# Altium schematic sheet Template_PS_2Layer_SCH.SchDoc: Complete Schematic
size B; Date: Not shown in title block; ApprovedBy: Not shown in title block; CheckedBy: Not shown in title block; Author: Not shown in title block; CompanyName: Not shown in title block; DrawnBy: Not shown in title block; Engineer: Not shown in title block; Organization: Not shown in title block; Address1: Not shown in title block; Address2: Not shown in title block; Address3: Not shown in title block; Address4: Not shown in title block; DocumentNumber: 1; Revision: Use project parameter SCH_Rev; SheetNumber: 1; SheetTotal: 1; PageSetup: Record=PageOptions|CenterHorizontal=True|CenterVertical=True|PrintScale=0.72|XCorrection=1.00|YCorrection=1.00|PrintKind=0|BorderSize=5000000|LeftOffset=0|BottomOffset=0|Orientation=2|PaperLength=1000|PaperWidth=1000|Scale=100|PaperSource=15|PrintQuality=600|MediaType=1|DitherType=10|PaperKind=Letter|PrintScaleMode=1; CurrentTime: Not shown in title block; CurrentDate: Not shown in title block; Time: Not shown in title block; DocumentFullPathAndName: Not shown in title block; DocumentName: Not shown in title block; ModifiedDate: Not shown in title block; ImagePath: Not shown in title block
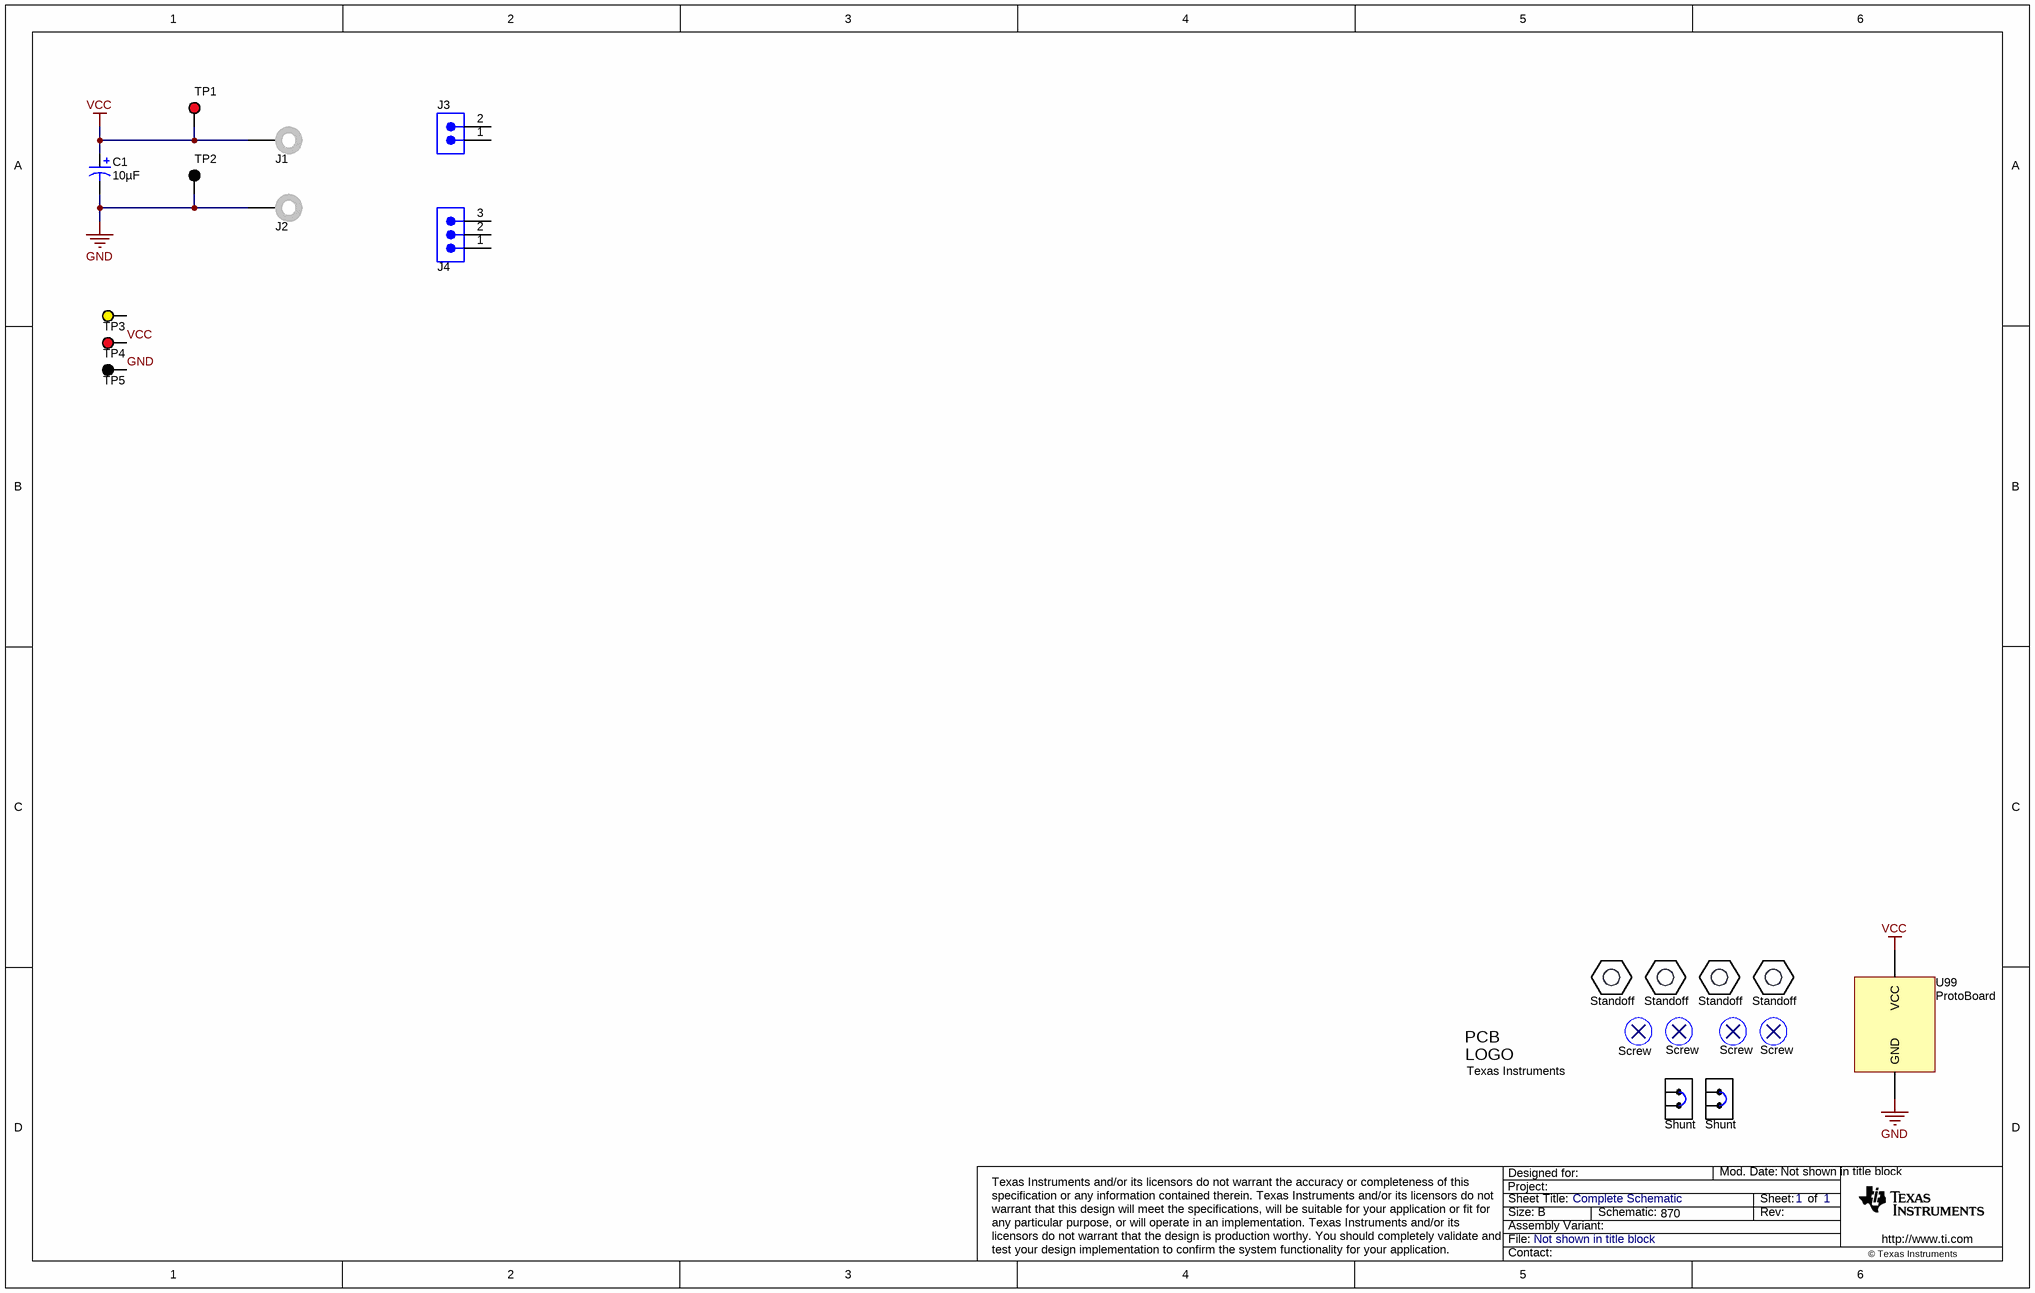
[diagram p0: Template_PS_2Layer_SCH.SchDoc]

## Parts
C1  ValueDisplayed: 10µF  [3528-21]  (hidden comment: TPSB106M020R1000)
J1  Banana Jack, Solder  [JACK NON-INSULATED .218"]  (value not drawn)
J2  Banana Jack, Solder  [JACK NON-INSULATED .218"]  (value not drawn)
J3  961102-6404-AR  [Header 100mil, 1x2]  (value not drawn)
J4  961103-6404-AR  [CONN HEADER VERT SGL 3POS GOLD]  (value not drawn)
J80  Shunt  (mechanical)
J81  Shunt  (mechanical)
Logo1  Texas Instruments  [TI_Symbol_Overlay_Small]  (no BOM)
TP1  5005  [Keystone5005]  (value not drawn)
TP2  5006  [Keystone5006]  (value not drawn)
TP3  5009  [Keystone5009]  (value not drawn)
TP4  5005  [Keystone5005]  (value not drawn)
TP5  5006  [Keystone5006]  (value not drawn)
U90  Standoff  [STANDOFF HEX 4-40THR ALUM 1"L]
U91  Standoff  [STANDOFF HEX 4-40THR ALUM 1"L]
U92  Standoff  [STANDOFF HEX 4-40THR ALUM 1"L]
U93  Standoff  [STANDOFF HEX 4-40THR ALUM 1"L]
U94  Screw  (mechanical)
U95  Screw  (mechanical)
U96  Screw  (mechanical)
U97  Screw  (mechanical)
U99  ProtoBoard  [ProtoArea]

## Nets
GND: C1.2(-) J2.1 TP2.1 TP5.1 U99.0(GND)
VCC: C1.1(+) J1.1 TP1.1 TP4.1 U99.17(VCC)

Not connected (* = marked no-connect by the designer): J3 1 2; J4 1 2 3; TP3 1

## Notes on the sheet
- Project:
- Designed for:
- Mod. Date:
- Sheet Title:
- Size:
- File:
- Assembly Variant:
- B
- Schematic:
- 870
- Rev:
- Sheet:
- of
- http://www.ti.com
- Texas Instruments and/or its licensors do not warrant the accuracy or completeness of this specification or any information contained therein. Texas Instruments and/or its licensors do not warrant that this design will meet the specifications, will be suitable for your application or fit for any particular purpose, or will operate in an implementation. Texas Instruments and/or its licensors do not warrant that the design is production worthy. You should completely validate and test your design implementation to confirm the system functionality for your application.
- Contact:
- © Texas Instruments
- (in symbol TI_Logo) PCB; LOGO

## Library data of the parts
C1 = TPSB106M020R1000: CAP, TANT, 10uF, 20V, +/-20%, 1 ohm, 3528-21 SMD; Manufacturer: AVX; Polarized: Y; CompType: Capacitor; U/M: EA; Cap_F: 0.00001; Tolerance_%: 20; Value1: 1 ohm; ESR_Ohm: 1; IRMS_A: 0.262; TaMin_C: -55; TaMax_C: 125; Cap_Case: B; SymbolVersion: 2008-07-09; Value: 10uF; PartNumber: TPSB106M020R1000; PackageReference: 3528-21; RoHS: Y; VDC_V: 20; Value2: 20V; MountType: SMT; Technology: TA; Series: TPS; Published: 2008-06-19; Publisher: Texas Instruments; LatestRevisionDate: 2012-08-28; LatestRevisionNote: Changed Publisher; ComponentLink1Description: Datasheet link; ComponentLink1URL: http://www.avx.com/docs/masterpubs/tantniob.pdf; Alternate PartNumber: -; Alternate Manufacturer: -; Supplier 1: Digi-Key; Supplier Part Number 1: 478-4087-1-ND; Supplier 2: Farnell; Supplier Part Number 2: 1612288; Supplier 3: Newark; Supplier Part Number 3: 36K3656
J1 J2 = Banana Jack, Solder: JACK NON-INSULATED .218"; Manufacturer: Keystone; PartNumber: 575-4; SymbolVersion: use current date i.e. 2008-05-20; SymbolCreator: Use LDAP id; CompType: Used in some BOM reports.  Useful for finding later.; U/M: EA, IN, or GM; MountType: TH; RoHS: Used in BOM report.  Use Y or N.; PackageReference: eg:  0603, used in PnP report; ComponentLink1Description: Datasheet Link; Alternate PartNumber: -; Alternate Manufacturer: -; Supplier 1: Digi-Key; Supplier Part Number 1: 575-4K-ND
J3 = CONN HEADER VERT SGL 2POS GOLD: Manufacturer: 3M; Alternate PartNumber: 3M9447-ND; SymbolVersion: use current date i.e. 2008-05-20; SymbolCreator: Use LDAP id; CompType: Used in some BOM reports.  Useful for finding later.; U/M: EA, IN, or GM; MountType: TH; RoHS: Y; PartNumber: 961102-6404-AR; PackageReference: eg:  0603, used in PnP report; ComponentLink1Description: Datasheet Link; Alternate Manufacturer: -; Supplier 1: Digi-Key; Supplier Part Number 1: 3M9447-ND
J4 = CONN HEADER VERT SGL 3POS GOLD: Manufacturer: 3M; SymbolVersion: use current date i.e. 2008-05-20; SymbolCreator: Use LDAP id; CompType: Used in some BOM reports.  Useful for finding later.; U/M: EA, IN, or GM; MountType: TH; RoHS: Used in BOM report.  Use Y or N.; PartNumber: 961103-6404-AR; PackageReference: eg:  0603, used in PnP report; ComponentLink1Description: Datasheet Link; Alternate PartNumber: -; Alternate Manufacturer: -; Supplier 1: Digi-Key; Supplier Part Number 1: 3M9448-ND
J80 J81 = Shunt, 100mil, Handle: SHUNT LP W/HANDLE 2 POS 30AU; Manufacturer: TE Connectivity; PartNumber: 881545-2; SymbolVersion: use current date i.e. 2008-05-20; SymbolCreator: Use LDAP id; CompType: Used in some BOM reports.  Useful for finding later.; U/M: EA, IN, or GM; MountType: SMT, TH, or N/A; RoHS: Used in BOM report.  Use Y or N.; PackageReference: eg:  0603, used in PnP report; ComponentLink1Description: Datasheet Link; Alternate PartNumber: -; Alternate Manufacturer: -; Supplier 1: Digi-Key; Supplier Part Number 1: A26242-ND
Logo1 = TI_Logo: Texas Instrument Corporate Signature; SymbolCreator: codlsc; SymbolVersion: 2011-08-22; ClassName: Logo; Published: 2009-03-03; Publisher: Texas Instruments; LatestRevisionDate: 2012-05-17; LatestRevisionNote: Changed publisher
TP1 TP4 = 5005: Test Point, TH, Compact, Red; Manufacturer: Keystone; Alternate Manufacturer: Any; Alternate PartNumber: Equivalent; CompType: Test Point Loop; U/M: EA; RoHS: Y; DigiKeyPartNumber: 5005K-ND; Value: Red; SymbolVersion: 2008-04-04; PartNumber: 5005; PackageReference: Keystone5005; ComponentLink1Description: Datasheet Link; ComponentLink1URL: http://www.keyelco.com/pdfs/M55p51.pdf; MountType: TH; Publisher: Texas Instruments; LatestRevisionDate: 2012-07-13; LatestRevisionNote: Changed publisher; Supplier 1: Digi-Key; Supplier Part Number 1: 5005K-ND
TP2 TP5 = 5006: Test Point, TH, Compact, Black; Manufacturer: Keystone; Alternate Manufacturer: Any; Alternate PartNumber: Equivalent; CompType: Test Point Loop; U/M: EA; RoHS: Y; DigiKeyPartNumber: 5006K-ND; Value: Black; SymbolVersion: 2008-04-04; PartNumber: 5006; PackageReference: Keystone5006; ComponentLink1Description: Datasheet Link; ComponentLink1URL: http://www.keyelco.com/pdfs/M55p51.pdf; MountType: TH; Publisher: Texas Instruments; LatestRevisionDate: 2012-07-13; LatestRevisionNote: Changed publisher; Supplier 1: Digi-Key; Supplier Part Number 1: 5006K-ND
TP3 = 5009: Test Point, TH, Compact, Yellow; Manufacturer: Keystone; Alternate Manufacturer: Any; Alternate PartNumber: Equivalent; CompType: Test Point Loop; U/M: EA; RoHS: Y; DigiKeyPartNumber: 5009K-ND; Value: Yellow; SymbolVersion: 2008-04-04; PartNumber: 5009; PackageReference: Keystone5009; ComponentLink1Description: Datasheet Link; ComponentLink1URL: http://www.keyelco.com/pdfs/M55p51.pdf; MountType: TH; Publisher: Texas Instruments; LatestRevisionDate: 2012-07-13; LatestRevisionNote: Changed publisher; Supplier 1: Digi-Key; Supplier Part Number 1: 5009K-ND
U90-U93 = Standoff, 1", 4-40, Alum, F-F: STANDOFF HEX 4-40THR ALUM 1"L; Manufacturer: Keystone; PartNumber: 2205; SymbolVersion: use current date i.e. 2008-05-20; SymbolCreator: Use LDAP id; CompType: Used in some BOM reports.  Useful for finding later.; U/M: EA, IN, or GM; MountType: SMT, TH, or N/A; RoHS: Used in BOM report.  Use Y or N.; PackageReference: eg:  0603, used in PnP report; ComponentLink1Description: Datasheet Link; Alternate PartNumber: -; Alternate Manufacturer: -; Supplier 1: Digi-Key; Supplier Part Number 1: 2205K-ND
U94-U97 = Machine Screw, 4-40, 0.25": MACHINE SCREW PAN PHILLIPS 4-40; Manufacturer: B&F Fastener Supply; PartNumber: PMSSS 440 0025 PH; SymbolVersion: use current date i.e. 2008-05-20; SymbolCreator: Use LDAP id; CompType: Mechanical; U/M: EA, IN, or GM; MountType: SMT, TH, or N/A; RoHS: Used in BOM report.  Use Y or N.; PackageReference: eg:  0603, used in PnP report; ComponentLink1Description: Datasheet Link; Alternate PartNumber: -; Alternate Manufacturer: -; Supplier 1: Digi-Key; Supplier Part Number 1: H703-ND
U99 = Proto: Prototype Area; Manufacturer: Used in BOM report; SymbolVersion: use current date i.e. 2008-05-20; SymbolCreator: Use LDAP id; CompType: Used in some BOM reports.  Useful for finding later.; U/M: EA, IN, or GM; MountType: SMT, TH, or N/A; RoHS: Used in BOM report.  Use Y or N.; PartNumber: Used in BOM report; PackageReference: eg:  0603, used in PnP report; ComponentLink1Description: Datasheet Link; Alternate PartNumber: -; Alternate Manufacturer: -